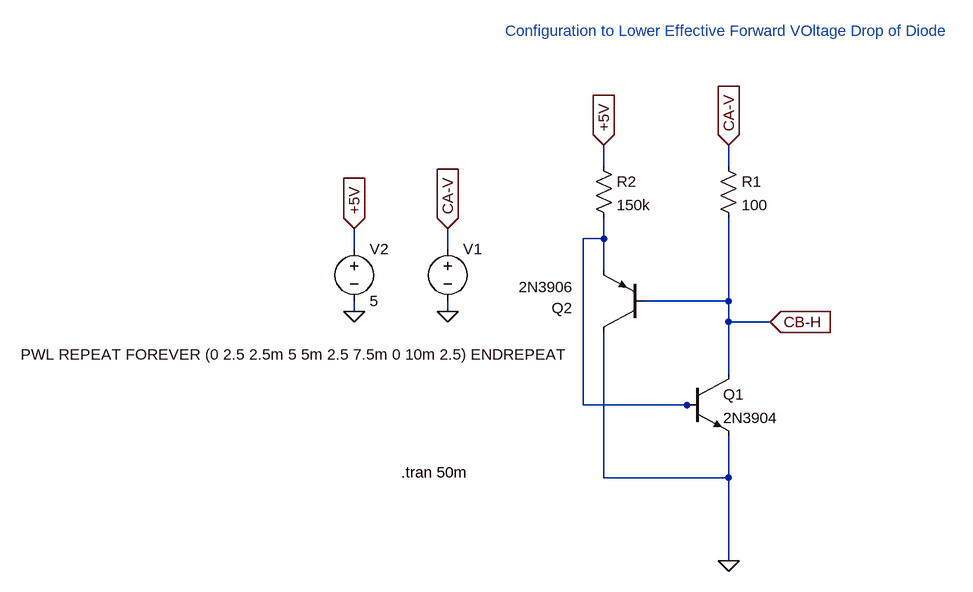
[diagram p0: schematic lower_forward_voltage_drop_ltspice.asc]
lower_forward_voltage_drop_ltspice.asc, the LTspice schematic file:
Version 4
SHEET 1 880 680
WIRE 48 -192 48 -224
WIRE 240 -192 240 -224
WIRE 48 -80 48 -112
WIRE 48 -80 16 -80
WIRE -336 -64 -336 -96
WIRE -192 -64 -192 -96
WIRE 48 -32 48 -80
WIRE 240 16 240 -112
WIRE 240 16 112 16
WIRE -336 32 -336 16
WIRE -192 32 -192 16
WIRE 240 48 240 16
WIRE 304 48 240 48
WIRE 240 128 240 48
WIRE 16 176 16 -80
WIRE 176 176 16 176
WIRE 192 176 176 176
WIRE 48 288 48 64
WIRE 240 288 240 224
WIRE 240 288 48 288
WIRE 240 416 240 288
FLAG 240 -224 CA-V
IOPIN 240 -224 In
FLAG 304 48 CB-H
IOPIN 304 48 In
FLAG -192 32 0
FLAG -192 -96 CA-V
IOPIN -192 -96 In
FLAG 240 416 0
FLAG 48 -224 +5V
IOPIN 48 -224 In
FLAG -336 32 0
FLAG -336 -96 +5V
IOPIN -336 -96 In
SYMBOL res 224 -208 R0
SYMATTR InstName R1
SYMATTR Value 100
SYMBOL voltage -192 -80 R0
WINDOW 3 -657 178 Left 2
WINDOW 123 0 0 Left 0
WINDOW 39 0 0 Left 0
SYMATTR Value PWL REPEAT FOREVER (0 2.5 2.5m 5 5m 2.5 7.5m 0 10m 2.5) ENDREPEAT
SYMATTR InstName V1
SYMBOL npn 176 128 R0
SYMATTR InstName Q1
SYMATTR Value 2N3904
SYMBOL pnp 112 64 R180
WINDOW 0 112 37 Left 2
WINDOW 3 110 70 Left 2
SYMATTR InstName Q2
SYMATTR Value 2N3906
SYMBOL res 32 -208 R0
SYMATTR InstName R2
SYMATTR Value 150k
SYMBOL voltage -336 -80 R0
WINDOW 123 0 0 Left 0
WINDOW 39 0 0 Left 0
SYMATTR InstName V2
SYMATTR Value 5
TEXT -264 280 Left 2 !.tran 50m
TEXT -104 -400 Left 2 ;Configuration to Lower Effective Forward VOltage Drop of Diode

The netlist it stands for:
* lower_forward_voltage_drop_ltspice.asc
R1 CA-V CB-H 100
V1 CA-V 0 PWL REPEAT FOREVER (0 2.5 2.5m 5 5m 2.5 7.5m 0 10m 2.5) ENDREPEAT
Q1 CB-H N001 0 0 2N3904
Q2 0 CB-H N001 0 2N3906
R2 +5V N001 150k
V2 +5V 0 5
.model NPN NPN
.model PNP PNP
.lib standard.bjt
.tran 50m
* Configuration to Lower Effective Forward VOltage Drop of Diode
.backanno
.end